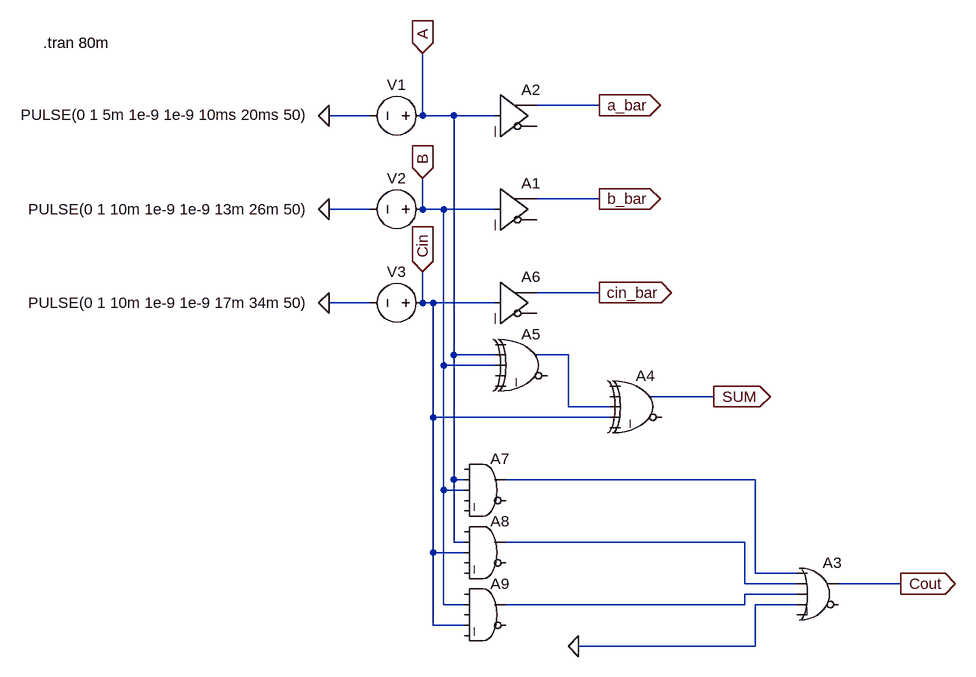
[diagram p0: schematic full_adder.asc]
full_adder.asc, the LTspice schematic file:
Version 4
SHEET 1 892 948
WIRE 304 96 208 96
WIRE -48 112 -112 112
WIRE 32 112 32 16
WIRE 80 112 32 112
WIRE 144 112 80 112
WIRE 304 112 304 96
WIRE 304 240 208 240
WIRE -48 256 -112 256
WIRE 32 256 32 208
WIRE 64 256 32 256
WIRE 144 256 64 256
WIRE 304 256 304 240
WIRE 304 384 208 384
WIRE -48 400 -112 400
WIRE 32 400 32 352
WIRE 48 400 32 400
WIRE 144 400 48 400
WIRE 304 400 304 384
WIRE 80 480 80 112
WIRE 144 480 80 480
WIRE 256 480 208 480
WIRE 64 496 64 256
WIRE 144 496 64 496
WIRE 480 544 384 544
WIRE 256 560 256 480
WIRE 320 560 256 560
WIRE 480 560 480 544
WIRE 48 576 48 400
WIRE 320 576 48 576
WIRE 80 672 80 480
WIRE 96 672 80 672
WIRE 544 672 160 672
WIRE 64 688 64 496
WIRE 96 688 64 688
WIRE 80 768 80 672
WIRE 96 768 80 768
WIRE 528 768 160 768
WIRE 48 784 48 576
WIRE 96 784 48 784
WIRE 544 816 544 672
WIRE 608 816 544 816
WIRE 528 832 528 768
WIRE 608 832 528 832
WIRE 768 832 672 832
WIRE 608 848 528 848
WIRE 768 848 768 832
WIRE 64 864 64 688
WIRE 96 864 64 864
WIRE 528 864 528 848
WIRE 528 864 160 864
WIRE 608 864 544 864
WIRE 48 896 48 784
WIRE 96 896 48 896
WIRE 544 928 544 864
WIRE 544 928 272 928
FLAG 304 96 a_bar
IOPIN 304 96 Out
FLAG -112 112 0
FLAG -112 256 0
FLAG 768 832 Cout
IOPIN 768 832 Out
FLAG -112 400 0
FLAG 32 16 A
IOPIN 32 16 In
FLAG 32 208 B
IOPIN 32 208 In
FLAG 32 352 Cin
IOPIN 32 352 In
FLAG 304 240 b_bar
IOPIN 304 240 Out
FLAG 304 384 cin_bar
IOPIN 304 384 Out
FLAG 272 928 0
FLAG 480 544 SUM
IOPIN 480 544 Out
SYMBOL Digital\\buf 144 48 R0
SYMATTR InstName A2
SYMBOL voltage 48 112 R90
WINDOW 0 -32 56 VBottom 2
WINDOW 3 -17 412 VTop 2
WINDOW 123 0 0 Left 0
WINDOW 39 0 0 Left 0
SYMATTR InstName V1
SYMATTR Value PULSE(0 1 5m 1e-9 1e-9 10ms 20ms 50)
SYMBOL voltage 48 256 R90
WINDOW 0 -32 56 VBottom 2
WINDOW 3 -16 406 VTop 2
WINDOW 123 0 0 Left 0
WINDOW 39 0 0 Left 0
SYMATTR InstName V2
SYMATTR Value PULSE(0 1 10m 1e-9 1e-9 13m 26m 50)
SYMBOL Digital\\xor 192 432 R0
SYMATTR InstName A5
SYMBOL voltage 48 400 R90
WINDOW 0 -32 56 VBottom 2
WINDOW 3 -16 406 VTop 2
WINDOW 123 0 0 Left 0
WINDOW 39 0 0 Left 0
SYMATTR InstName V3
SYMATTR Value PULSE(0 1 10m 1e-9 1e-9 17m 34m 50)
SYMBOL Digital\\buf 144 192 R0
SYMATTR InstName A1
SYMBOL Digital\\buf 144 336 R0
SYMATTR InstName A6
SYMBOL Digital\\and 128 624 R0
SYMATTR InstName A7
SYMBOL Digital\\and 128 720 R0
SYMATTR InstName A8
SYMBOL Digital\\and 128 816 R0
SYMATTR InstName A9
SYMBOL Digital\\xor 368 496 R0
SYMATTR InstName A4
SYMBOL Digital\\or 640 784 R0
SYMATTR InstName A3
TEXT -552 0 Left 2 !.tran 80m

The netlist it stands for:
* full_adder.asc
A2 A 0 0 0 0 0 a_bar 0 BUF
V1 A 0 PULSE(0 1 5m 1e-9 1e-9 10ms 20ms 50)
V2 B 0 PULSE(0 1 10m 1e-9 1e-9 13m 26m 50)
A5 0 A B 0 0 0 N001 0 XOR
V3 Cin 0 PULSE(0 1 10m 1e-9 1e-9 17m 34m 50)
A1 B 0 0 0 0 0 b_bar 0 BUF
A6 Cin 0 0 0 0 0 cin_bar 0 BUF
A7 0 A B 0 0 0 N002 0 AND
A8 0 A Cin 0 0 0 N003 0 AND
A9 0 B 0 Cin 0 0 N004 0 AND
A4 0 0 N001 Cin 0 0 SUM 0 XOR
A3 N002 N003 N004 0 0 0 Cout 0 OR
.tran 80m
.backanno
.end